# EAGLE design reverb (EAGLE 6.6.0)
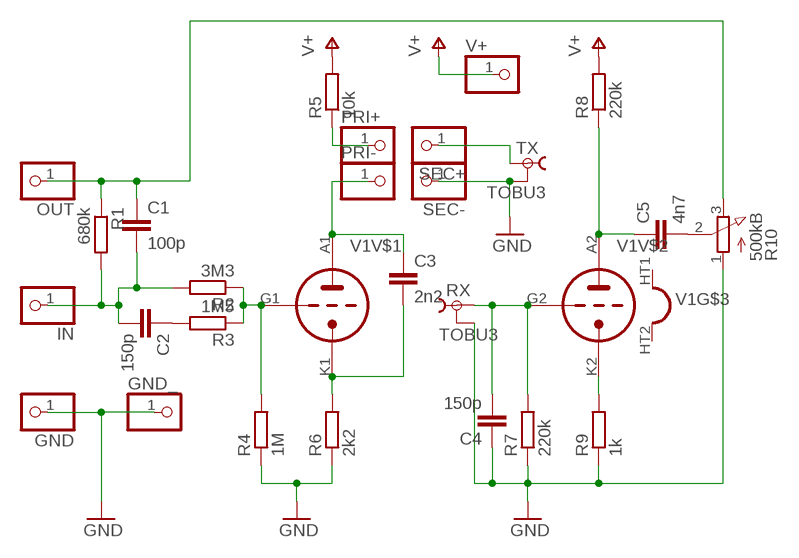
[diagram p0: schematic, sheet 1]

## Parts
C1  100p  C-EU050-030X075  [C050-030X075]
C2  150p  C-EU050-030X075  [C050-030X075]
C3  2n2  C-EU050-030X075  [C050-030X075]
C4  150p  C-EU050-030X075  [C050-030X075]
C5  4n7  C-EU050-045X075  [C050-045X075]
GND  PINHD-1X1  [1X01]
GND_  PINHD-1X1  [1X01]
IN  PINHD-1X1  [1X01]
OUT  PINHD-1X1  [1X01]
PRI+  PINHD-1X1  [1X01]
PRI-  PINHD-1X1  [1X01]
R1  680k  R-EU_0207/7  [0207/7]
R2  3M3  R-EU_0207/7  [0207/7]
R3  1M5  R-EU_0207/7  [0207/7]
R4  1M  R-EU_0207/7  [0207/7]
R5  10k  R-EU_0207/7  [0207/7]
R6  2k2  R-EU_0207/7  [0207/7]
R7  220k  R-EU_0207/7  [0207/7]
R8  220k  R-EU_0207/7  [0207/7]
R9  1k  R-EU_0207/7  [0207/7]
R10  500kB  3RP/1610N  [3RP/1610N]
RX  TOBU3  [TOBU3]
SEC+  PINHD-1X1  [1X01]
SEC-  PINHD-1X1  [1X01]
TX  TOBU3  [TOBU3]
V1  6NXX-PIT  [6NXX-PIT]
V+  PINHD-1X1  [1X01]

## Nets
GND: C4.1 GND.1 GND_.1 R4.1 R6.1 R7.1 R9.1 R10.1(A) RX.2 RX.2@1 RX.2@2 SEC-.1 TX.2 TX.2@1 TX.2@2
N$1: C3.2 R6.2 V1.K1(V$1:TK)
N$2: R2.1 R3.1 R4.2 V1.G1(V$1:TG)
N$3: C4.2 R7.2 RX.1 V1.G2(V$2:TG)
N$4: R9.2 V1.K2(V$2:TK)
N$5: C2.1 R3.2
N$8: C5.1 R8.1 V1.A2(V$2:TA)
N$9: PRI+.1 R5.1
N$10: C3.1 PRI-.1 V1.A1(V$1:TA)
N$12: SEC+.1 TX.1
N$23: C1.2 C2.2 IN.1 R1.2 R2.2
N$24: C5.2 R10.2(S)
N$25: C1.1 OUT.1 R1.1 R10.3(E)
V+: R5.2 R8.2 V+.1
Unconnected: V1.HT1(H1) V1.HT2(H2)

## Library data of the parts
C1-C5 = rcl:C-EU: CAPACITOR, European symbol
GND GND_ IN OUT PRI+ PRI- SEC+ SEC- V+ = adafruit:PINHD-1X1: Pin header 1x1 for 0.1" spacing With round pins
R1-R9 = rcl:R-EU_: RESISTOR, European symbol
R10 = pot:3RP/1610N: 16mm Potentiometer one level Source: http://www.alphapotentiometers.net/html/16mm_pot_2.html
RX TX = con-hirschmann:TOBU3: Female Cinch CONNECTOR ( RCA Jack ); MF: FARNELL; MPN: TOBU 3; OC_FARNELL: 592791; OC_NEWARK: 06WX5914
V1 = tubesC:6NXX-PIT

## Board
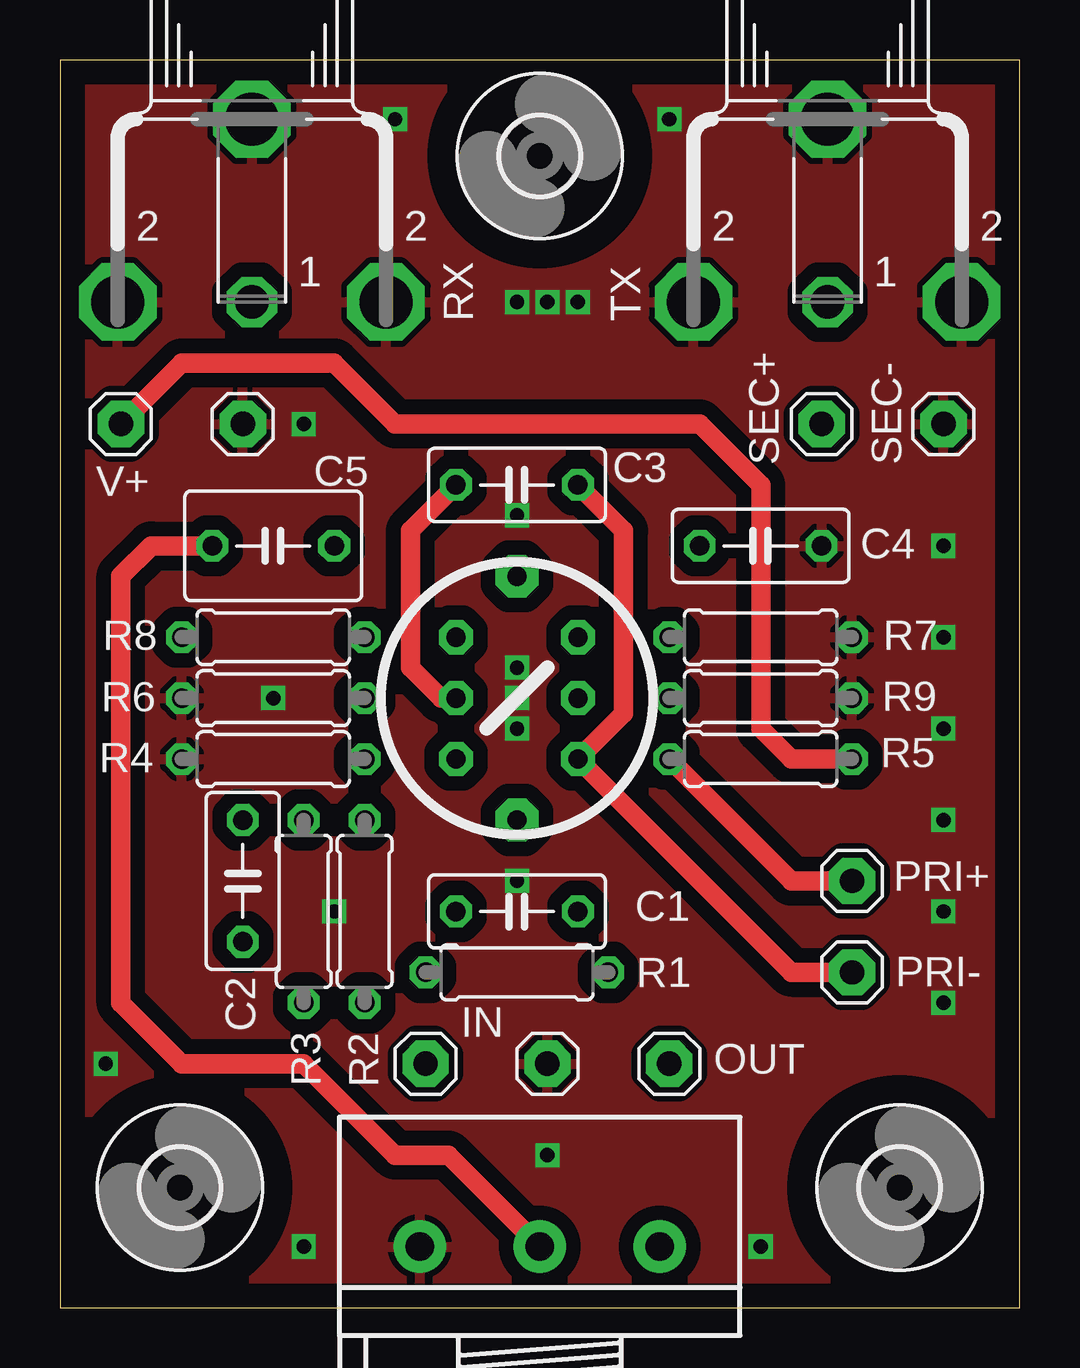
[diagram p1: board, top side]
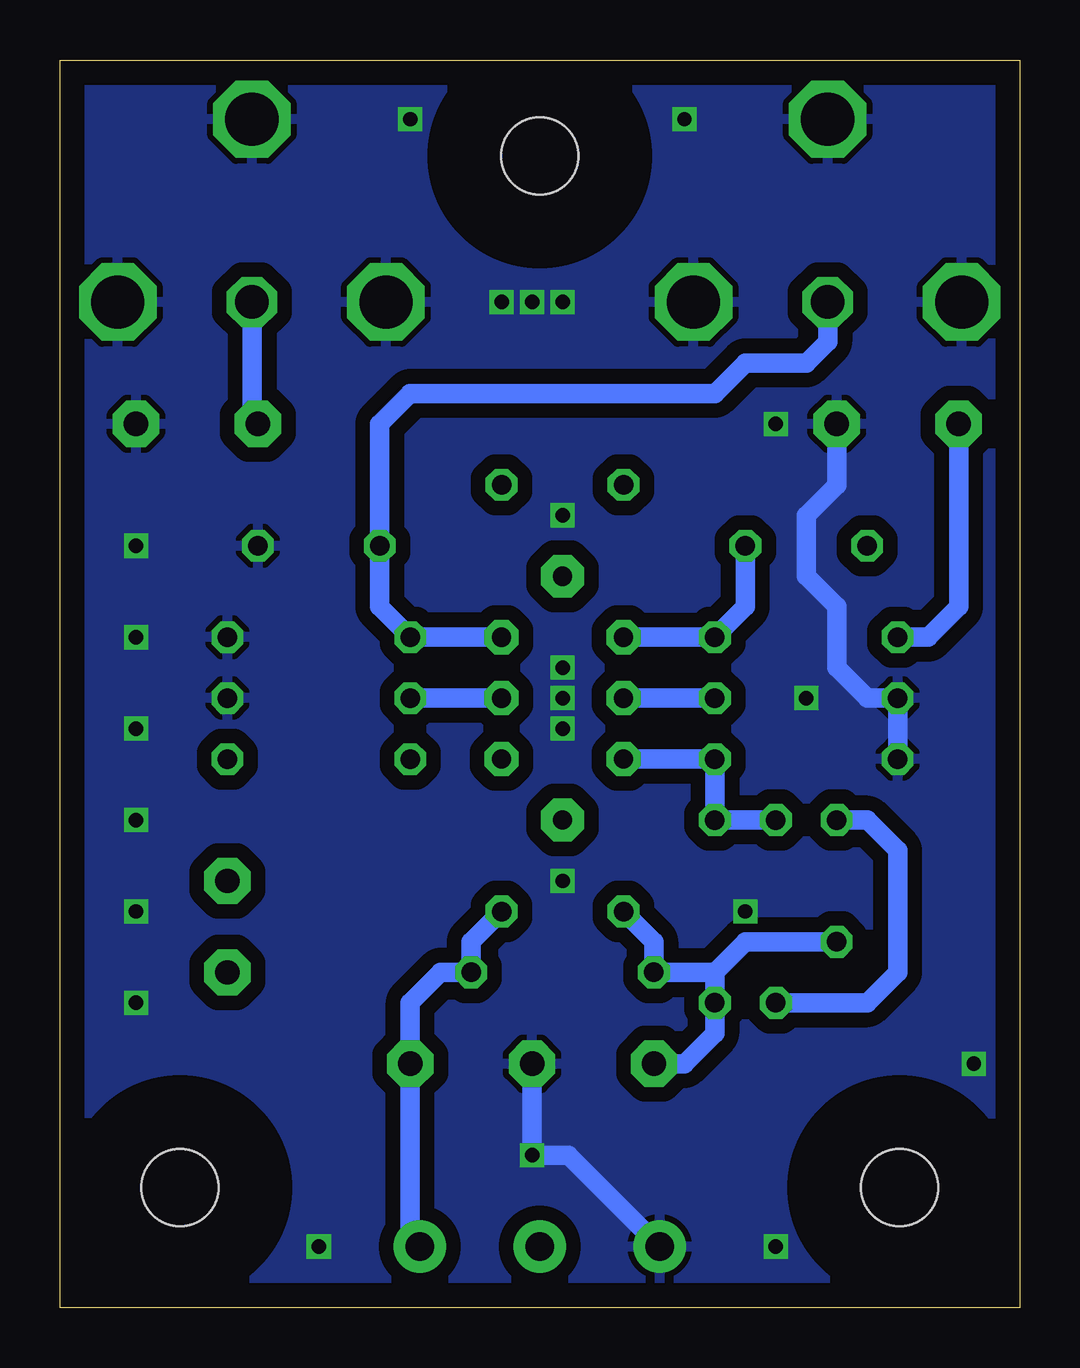
[diagram p2: board, bottom side, seen from below]

Size 40 x 52 mm. Coordinates in mm from the lower left corner, seen from the top.
Outline: 0,0 40,0 40,52 0,52 0,0
Copper layers (1*16): Top 0.035mm / dielectric 1.5mm / Bottom 0.035mm
Design rules "default": minimum track width 10mil, minimum drill 24mil, track to track 8mil, track to pad 8mil, pad to pad 8mil, via to via 8mil, smd to smd 8mil, copper to edge 40mil, drill to drill 8mil, minimum pad ring 10mil, minimum via ring 8mil, stop-mask expansion 4mil, vias tented up to drill 0mil, thermal gap 10mil

### Footprints (pad centres in the part's own frame; a part is rotated, then mirrored left to right if it is on the bottom)
C050-030X075 = drill 0.813 octagon: 1 -2.54,0; 2 2.54,0
C050-045X075 = drill 0.813 octagon: 1 -2.54,0; 2 2.54,0
1X01 = drill 1.016 pad 1.93 octagon: 1 0,0
0207/7 = drill 0.813 octagon: 1 -3.81,0; 2 3.81,0
3RP/1610N = drill 1.2 pad 2.184: 1 -5,0; 2 0,0; 3 5,0
TOBU3 = drill 1.397 octagon: 1 0,-2.54 | drill 2.21 octagon: 2 5.588,-2.54; 2@1 -5.588,-2.54; 2@2 0,5.08
3,2 = hole 3.2: 0,0
6NXX-PIT = drill 0.8 pad 1.422 octagon: A1 2.54,-2.54; A2 -2.54,2.54; G1 -2.54,-2.54; G2 2.54,2.54; K1 -2.54,0; K2 2.54,0 | drill 0.8 pad 1.778 octagon: HT1 0,5.08; HT2 0,-5.08

### Placement (x,y rotation side)
C1  19.05,16.51 180 top
C2  7.62,17.78 270 top
C3  19.05,34.29 180 top
C4  29.21,31.75 180 top
C5  8.89,31.75 180 top
GND  7.62,36.83 0 top
GND_  20.32,10.16 0 top
IN  15.24,10.16 0 top
OUT  25.4,10.16 0 top
PRI+  33.02,17.78 0 top
PRI-  33.02,13.97 0 top
R1  19.05,13.97 180 top
R2  12.7,16.51 270 top
R3  10.16,16.51 270 top
R4  8.89,22.86 0 top
R5  29.21,22.86 0 top
R6  8.89,25.4 0 top
R7  29.21,27.94 180 top
R8  8.89,27.94 180 top
R9  29.21,25.4 180 top
R10  20,2.54 0 top
RX  8,44.45 0 top
SEC+  31.75,36.83 0 top
SEC-  36.83,36.83 0 top
TX  32,44.45 0 top
U$1  [3,2]  35,5 0 top
U$2  [3,2]  5,5 0 top
U$3  [3,2]  20,48 0 top
V1  19.05,25.4 0 top
V+  2.54,36.83 0 top

### Tracks (layer width: path | path; a pad name or v marks a point on that pad's centre or on a via)
GND  (via drill 0.6)
  Bottom 0.813: R10.1 18.81,6.35 v20.32,6.35 GND_.1 | R4.1 R6.1 6.35,25.4 7.62,26.67 7.62,29.21 8.89,30.48 8.89,33.02 7.62,34.29 GND.1
  other vias: 25.4,49.53 13.97,49.53 19.05,25.4 10.16,2.54 29.21,2.54 19.05,26.67 19.05,24.13 19.05,17.78 19.05,33.02 10.16,36.83 36.83,24.13 36.83,27.94 36.83,31.75 19.05,41.91 20.32,41.91 21.59,41.91 11.43,16.51 1.91,10.16 8.89,25.4 36.83,12.7 36.83,16.51 36.83,20.32
  pour Bottom (isolate 0.61): 0,53.34 40.64,53.34 40.64,50.8 40.64,0 0,0
  pour Top (isolate 0.61): 0,53.34 0,0 40.64,0 40.64,53.34
N$1
  Top 0.813: V1.K1 15.88,25.4 14.61,26.67 14.61,32.38 C3.2
  Bottom 0.813: V1.K1 R6.2
N$2
  Bottom 0.813: V1.G1 R4.2 R2.1 R3.1
N$3
  Bottom 0.813: V1.G2 R7.2 26.67,29.21 C4.2 26.67,36.83 25.4,38.1 12.7,38.1 11.43,39.37 8.89,39.37 8,40.26 RX.1
N$4
  Bottom 0.813: R9.2 V1.K2
N$5
  Bottom 0.813: R3.2 6.35,12.7 5.08,13.97 5.08,19.05 6.35,20.32 C2.1
N$8
  Bottom 0.813: V1.A2 R8.1 11.43,29.21 C5.1
N$9
  Top 0.813: R5.1 30.48,17.78 PRI+.1
N$10
  Top 0.813: C3.1 23.5,32.38 23.5,24.77 V1.A1 30.48,13.97 PRI-.1
N$12
  Bottom 0.813: TX.1 32,37.08 SEC+.1
N$23
  Bottom 0.813: C1.2 15.24,15.24 R1.2 12.7,13.97 | C2.2 11.43,15.24 12.7,13.97 | 12.7,13.97 R2.2 12.7,11.43 13.97,10.16 IN.1
N$24
  Top 0.813: R10.2 16.19,6.35 13.97,6.35 10.16,10.16 5.08,10.16 2.54,12.7 2.54,30.48 3.81,31.75 C5.2
N$25
  Bottom 0.813: C1.1 22.86,15.24 R1.1 24.13,13.97 25.4,12.7 OUT.1 25.4,2.94 R10.3
V+
  Top 0.813: R5.2 30.48,22.86 29.21,24.13 29.21,34.29 26.67,36.83 13.97,36.83 11.43,39.37 5.08,39.37 V+.1
  Bottom 0.813: R8.2 3.81,27.94 2.54,29.21 V+.1